# Altium schematic sheet Main_Board_Controller.SchDoc
size A4; SheetNumber: 1; SheetTotal: 2
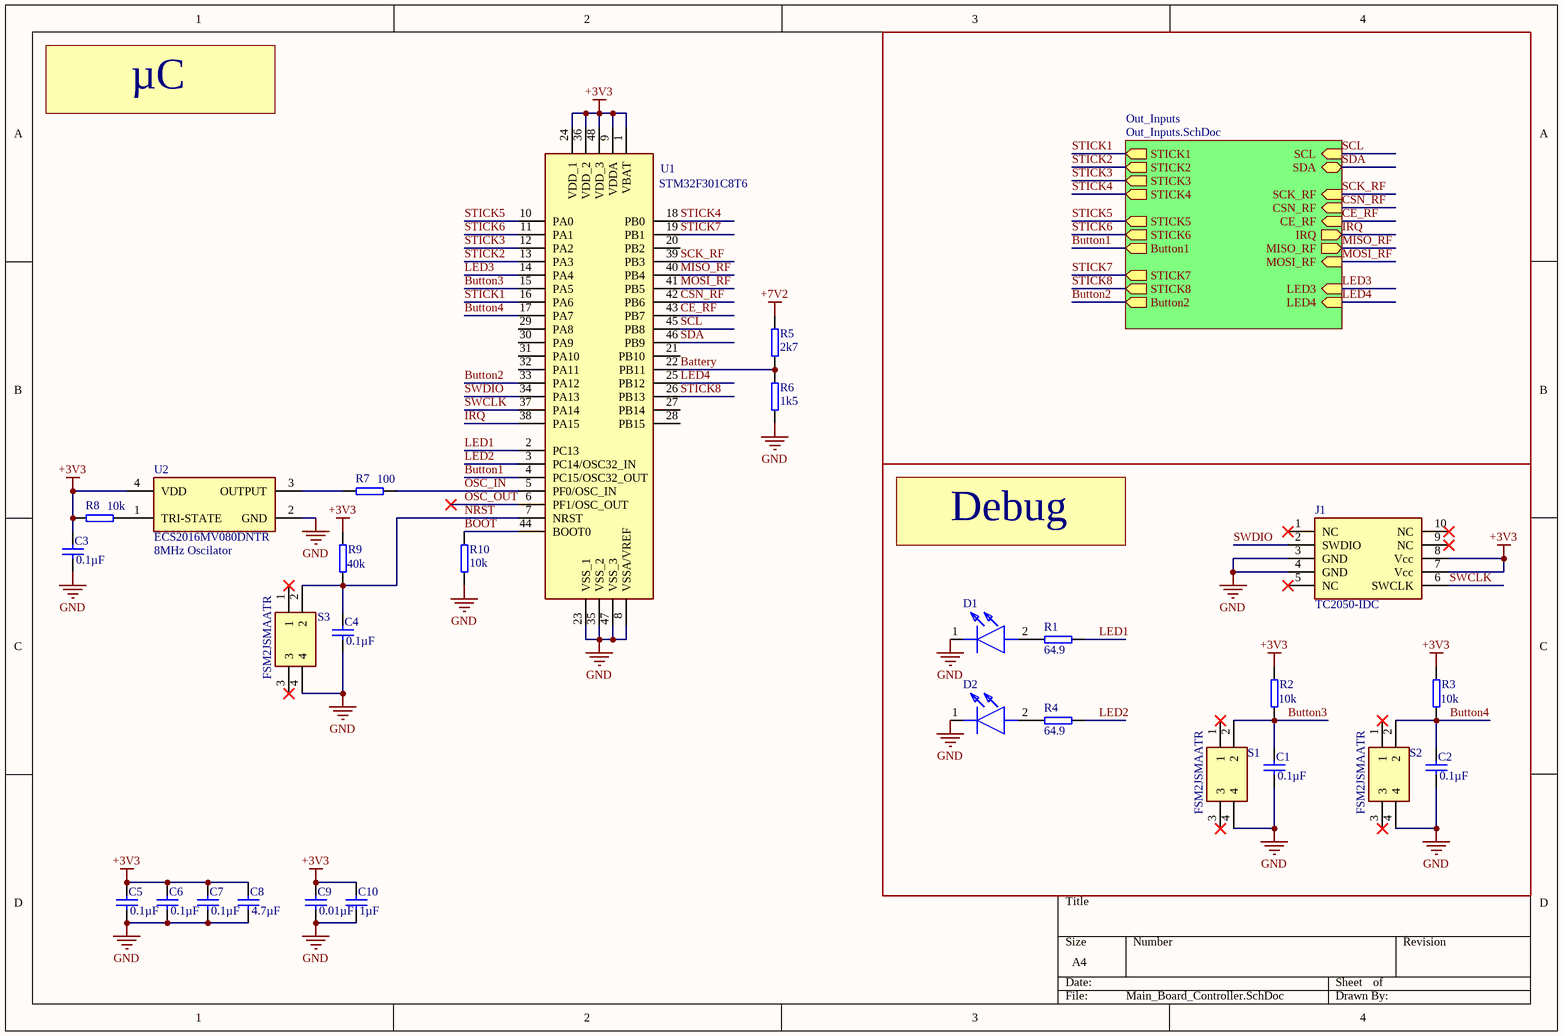
[diagram p0: Main_Board_Controller.SchDoc]

## Parts
C1  0.1µF  [Capacitor 0603]
C2  0.1µF  [Capacitor 0603]
C3  0.1µF  [Capacitor 0603]
C4  0.1µF  [Capacitor 0603]
C5  0.1µF  [Capacitor 0603]
C6  0.1µF  [Capacitor 0603]
C7  0.1µF  [Capacitor 0603]
C8  4.7µF  [Capacitor 0603]
C9  0.01µF  [Capacitor 0603]
C10  1µF  [Capacitor 0603]
D1  LED 1608 (0603) SMD  [INS21AT2G]  (value not drawn)
D2  LED 1608 (0603) SMD  [INS21AT2G]  (value not drawn)
J1  TC2050-IDC  [TAG-CONNECT_TC2050-IDC]
R1  64.9  [Resistor 0603]
R2  10k  [Resistor 0603]
R3  10k  [Resistor 0603]
R4  64.9  [Resistor 0603]
R5  2k7  [Resistor 0603]
R6  1k5  [Resistor 0603]
R7  100  [Resistor 0603]
R8  10k  [Resistor 0603]
R9  40k  [Resistor 0603]
R10  10k  [Resistor 0603]
S1  FSM2JSMAATR  [FSM2J_1]
S2  FSM2JSMAATR  [FSM2J_1]
S3  FSM2JSMAATR  [FSM2J_1]
U1  STM32F301C8T6  [QFP50P900X900X160-48N]
U2  ECS2016MV080DNTR  [OSC_ECS-1618-300-BN-TR]

## Sub-sheets
Out_Inputs = Out_Inputs.SchDoc: STICK1 (out), STICK2 (out), STICK3 (out), STICK4 (out), SCL (in), SDA (bidir), SCK_RF (in), CSN_RF (in), CE_RF (in), IRQ (out), MISO_RF (out), MOSI_RF (in), LED3 (in), LED4 (in), STICK5 (out), STICK6 (out), STICK7 (out), STICK8 (out), Button2 (out), Button1 (out)

## Nets
+3V3: C3.1 C5.1 C6.1 C7.1 C8.1 C9.1 C10.1 J1.7(Vcc) J1.8(Vcc) R2.1 R3.1 R8.2 R9.1 U1.1(VBAT) U1.9(VDDA) U1.24(VDD_1) U1.36(VDD_2) U1.48(VDD_3) U2.4(VDD)
+7V2: R5.2
GND: C1.2 C2.2 C3.2 C4.2 C5.2 C6.2 C7.2 C8.2 C9.2 C10.2 D1.1(K) D2.1(K) J1.3(GND) J1.4(GND) R6.1 R10.1 S1.4 S2.4 S3.4 U1.8(VSSA/VREF) U1.23(VSS_1) U1.35(VSS_2) U1.47(VSS_3) U2.2(GND)
Battery: R5.1 R6.2 U1.22(PB11)
BOOT: R10.2 U1.44(BOOT0)
Button1: U1.4(PC15/OSC32_OUT) ; sheet Out_Inputs/Button1
Button2: U1.33(PA12) ; sheet Out_Inputs/Button2
Button3: C1.1 R2.2 S1.2 U1.15(PA5)
Button4: C2.1 R3.2 S2.2 U1.17(PA7)
CE_RF: U1.43(PB7) ; sheet Out_Inputs/CE_RF
CSN_RF: U1.42(PB6) ; sheet Out_Inputs/CSN_RF
IRQ: U1.38(PA15) ; sheet Out_Inputs/IRQ
LED1: R1.1 U1.2(PC13)
LED2: R4.1 U1.3(PC14/OSC32_IN)
LED3: U1.14(PA4) ; sheet Out_Inputs/LED3
LED4: U1.25(PB12) ; sheet Out_Inputs/LED4
MISO_RF: U1.40(PB4) ; sheet Out_Inputs/MISO_RF
MOSI_RF: U1.41(PB5) ; sheet Out_Inputs/MOSI_RF
NRST: C4.1 R9.2 S3.2 U1.7(NRST)
OSC_IN: R7.1 U1.5(PF0/OSC_IN)
OSC_OUT: U1.6(PF1/OSC_OUT)
SCK_RF: U1.39(PB3) ; sheet Out_Inputs/SCK_RF
SCL: U1.45(PB8) ; sheet Out_Inputs/SCL
SDA: U1.46(PB9) ; sheet Out_Inputs/SDA
STICK1: U1.16(PA6) ; sheet Out_Inputs/STICK1
STICK2: U1.13(PA3) ; sheet Out_Inputs/STICK2
STICK3: U1.12(PA2) ; sheet Out_Inputs/STICK3
STICK4: U1.18(PB0) ; sheet Out_Inputs/STICK4
STICK5: U1.10(PA0) ; sheet Out_Inputs/STICK5
STICK6: U1.11(PA1) ; sheet Out_Inputs/STICK6
STICK7: U1.19(PB1) ; sheet Out_Inputs/STICK7
STICK8: U1.26(PB13) ; sheet Out_Inputs/STICK8
SWCLK: J1.6(SWCLK) U1.37(PA14)
SWDIO: J1.2(SWDIO) U1.34(PA13)
NetD1_2: D1.2(A) R1.2
NetD2_2: D2.2(A) R4.2
NetR7_2: R7.2 U2.3(OUTPUT)
NetR8_1: R8.1 U2.1(TRI-STATE)

Not connected (* = marked no-connect by the designer): J1 1(NC)* 5(NC)* 9(NC)* 10(NC)*; S1 1* 3*; S2 1* 3*; S3 1* 3*; U1 20(PB2) 21(PB10) 27(PB14) 28(PB15) 29(PA8) 30(PA9) 31(PA10) 32(PA11)

## Notes on the sheet
- µC
- (near U2) 8MHz Oscilator
- Debug

## Library data of the parts
C1-C10 = Capacitor 0603: Capacitor
J1 = TC2050-IDC: CBL PLUG-OF-NAILS 10-PIN W/LEGS; MF: Tag-Connect LLC; Package: None; Digi-Key_Part_Number: TC2050-IDC-ND; Value: *; MP: TC2050-IDC; SnapEDA_Link: https://www.snapeda.com/parts/TC2050-IDC/Tag-Connect%20LLC/view-part/134529/?ref=snap; Digi-Key_Purchase_URL: https://www.digikey.com/product-detail/en/tag-connect-llc/TC2050-IDC/TC2050-IDC-ND/2605366?utm_source=snapeda&utm_medium=aggregator&utm_campaign=symbol
R1-R10 = Resistor 0603: Resistor
S1-S3 = FSM2JSMAATR: Switch; Manufacturer_Name: TE Connectivity; Datasheet Link: http://www.te.com/commerce/DocumentDelivery/DDEController?Action=showdoc&DocId=Customer+Drawing%7F2-1437565-7%7FV%7Fpdf%7FEnglish%7FENG_CD_2-1437565-7_V.pdf%7F2-1437565-9; Manufacturer_Part_Number: FSM2JSMAATR; Mouser Part Number: 506-FSM2JSMAATR; Mouser Price/Stock: https://www.mouser.co.uk/ProductDetail/TE-Connectivity-Alcoswitch/FSM2JSMAATR?qs=g%252BEszo6zu8MKdISiZRITCQ%3D%3D; Arrow Part Number: FSM2JSMAATR; Arrow Price/Stock: https://www.arrow.com/en/products/fsm2jsmaatr/te-connectivity?region=nac
U1 = STM32F301C8T6: STMICROELECTRONICS - STM32F301C8T6 - MCU, 32BIT, CORTEX-M4, 72MHZ, LQFP-48; Geometry.Height: 1.6mm; Mouser Part Number: 511-STM32F301C8T6; Mouser Price/Stock: https://www.mouser.co.uk/ProductDetail/STMicroelectronics/STM32F301C8T6?qs=DqCdCwOw4%2F52bYCbIDWtEg%3D%3D; Manufacturer_Name: STMicroelectronics; Manufacturer_Part_Number: STM32F301C8T6; Datasheet Link: https://www.st.com/resource/en/datasheet/stm32f301c8.pdf
U2 = ECS-2016MV-250-CN-TR3: 25 MHz XO (Standard) HCMOS Oscillator 1.8V ~ 3.3V Enable/Disable 4-SMD, No Lead; MF: ECS Inc.; SnapEDA_Link: https://www.snapeda.com/parts/ECS-2016MV-250-CN-TR3/ECS+Inc./view-part/?ref=snap; Value: *; Purchase-URL: https://pricing.snapeda.com/search/part/ECS-2016MV-250-CN-TR3/?ref=eda; Check_prices: https://www.snapeda.com/parts/ECS-2016MV-250-CN-TR3/ECS+Inc./view-part/?ref=eda; Availability: In Stock; Price: None; MP: ECS-2016MV-250-CN-TR3; Package: None